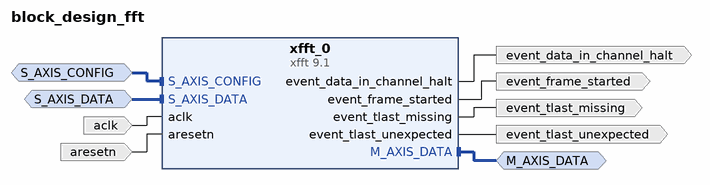
[diagram p0: block diagram of the top level]
# Vivado block design block_design_fft, xc7z020clg484-1, Vivado 2023.2.2
create_bd_design block_design_fft

create_bd_intf_port -mode Master -vlnv xilinx.com:interface:axis_rtl:1.0 M_AXIS_DATA
create_bd_intf_port -mode Slave -vlnv xilinx.com:interface:axis_rtl:1.0 S_AXIS_CONFIG
set_property -dict [list \
  CONFIG.HAS_TKEEP 0 \
  CONFIG.HAS_TLAST 0 \
  CONFIG.HAS_TREADY 1 \
  CONFIG.HAS_TSTRB 0 \
  CONFIG.LAYERED_METADATA undef \
  CONFIG.TDATA_NUM_BYTES 1 \
  CONFIG.TDEST_WIDTH 0 \
  CONFIG.TID_WIDTH 0 \
  CONFIG.TUSER_WIDTH 0 \
] [get_bd_intf_ports S_AXIS_CONFIG]
create_bd_intf_port -mode Slave -vlnv xilinx.com:interface:axis_rtl:1.0 S_AXIS_DATA
set_property -dict [list \
  CONFIG.HAS_TKEEP 0 \
  CONFIG.HAS_TLAST 1 \
  CONFIG.HAS_TREADY 1 \
  CONFIG.HAS_TSTRB 0 \
  CONFIG.LAYERED_METADATA undef \
  CONFIG.TDATA_NUM_BYTES 4 \
  CONFIG.TDEST_WIDTH 0 \
  CONFIG.TID_WIDTH 0 \
  CONFIG.TUSER_WIDTH 0 \
] [get_bd_intf_ports S_AXIS_DATA]
create_bd_port -dir I -type clk aclk
create_bd_port -dir I -type rst aresetn
create_bd_port -dir O -type intr event_data_in_channel_halt
create_bd_port -dir O -type intr event_frame_started
create_bd_port -dir O -type intr event_tlast_missing
create_bd_port -dir O -type intr event_tlast_unexpected

create_bd_cell -type ip -vlnv xilinx.com:ip:xfft:9.1 xfft_0
set_property -dict [list \
  CONFIG.aresetn true \
  CONFIG.cyclic_prefix_insertion false \
  CONFIG.implementation_options automatically_select \
  CONFIG.number_of_stages_using_block_ram_for_data_and_phase_factors 0 \
  CONFIG.output_ordering natural_order \
  CONFIG.scaling_options unscaled \
  CONFIG.target_clock_frequency 100 \
  CONFIG.target_data_throughput 10 \
  CONFIG.throttle_scheme realtime \
  CONFIG.transform_length 64 \
] [get_bd_cells xfft_0]

# ---- connections ----

connect_bd_intf_net -intf_net S_AXIS_CONFIG_0_1 [get_bd_intf_ports S_AXIS_CONFIG] [get_bd_intf_pins xfft_0/S_AXIS_CONFIG]
connect_bd_intf_net -intf_net S_AXIS_DATA_0_1 [get_bd_intf_ports S_AXIS_DATA] [get_bd_intf_pins xfft_0/S_AXIS_DATA]
connect_bd_intf_net [get_bd_intf_ports M_AXIS_DATA] [get_bd_intf_pins xfft_0/M_AXIS_DATA]
connect_bd_net -net aclk_0_1 [get_bd_ports aclk] [get_bd_pins xfft_0/aclk]
connect_bd_net -net aresetn_0_1 [get_bd_ports aresetn] [get_bd_pins xfft_0/aresetn]
connect_bd_net [get_bd_pins xfft_0/event_data_in_channel_halt] [get_bd_ports event_data_in_channel_halt]
connect_bd_net [get_bd_pins xfft_0/event_frame_started] [get_bd_ports event_frame_started]
connect_bd_net [get_bd_pins xfft_0/event_tlast_missing] [get_bd_ports event_tlast_missing]
connect_bd_net [get_bd_pins xfft_0/event_tlast_unexpected] [get_bd_ports event_tlast_unexpected]

validate_bd_design
save_bd_design
